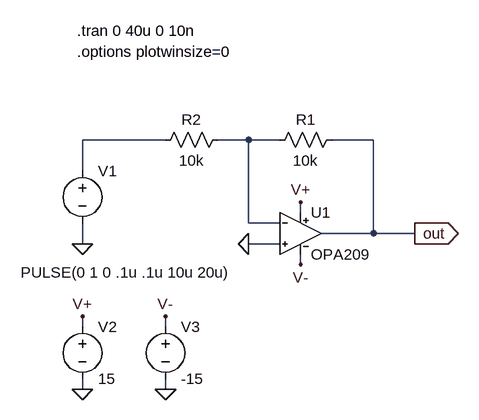
[diagram p0: schematic OPA209_test.asc]
OPA209_test.asc, the LTspice schematic file:
Version 4
SHEET 1 880 680
WIRE 32 48 -96 48
WIRE 160 48 112 48
WIRE 208 48 160 48
WIRE 352 48 288 48
WIRE -96 96 -96 48
WIRE 240 160 240 144
WIRE 160 176 160 48
WIRE 208 176 160 176
WIRE 352 192 352 48
WIRE 352 192 272 192
WIRE 416 192 352 192
WIRE -96 208 -96 176
WIRE 208 208 160 208
WIRE 240 240 240 224
WIRE -96 336 -96 320
WIRE 32 336 32 320
WIRE -96 432 -96 416
WIRE 32 432 32 416
FLAG 240 144 V+
FLAG 240 240 V-
FLAG 160 208 0
FLAG -96 208 0
FLAG 416 192 out
IOPIN 416 192 Out
FLAG 32 432 0
FLAG -96 432 0
FLAG -96 320 V+
FLAG 32 320 V-
SYMBOL res 192 64 R270
WINDOW 0 32 56 VTop 0
WINDOW 3 0 56 VBottom 0
SYMATTR InstName R1
SYMATTR Value 10k
SYMBOL res 16 64 R270
WINDOW 0 32 56 VTop 0
WINDOW 3 0 56 VBottom 0
SYMATTR InstName R2
SYMATTR Value 10k
SYMBOL voltage -96 80 R0
WINDOW 3 -95 172 Left 0
WINDOW 123 0 0 Left 0
WINDOW 39 0 0 Left 0
SYMATTR Value PULSE(0 1 0 .1u .1u 10u 20u)
SYMATTR InstName V1
SYMBOL voltage -96 320 R0
SYMATTR InstName V2
SYMATTR Value 15
SYMBOL voltage 32 320 R0
SYMATTR InstName V3
SYMATTR Value -15
SYMBOL OPA209 240 128 R0
SYMATTR InstName U1
TEXT -104 -120 Left 0 !.tran 0 40u 0 10n
TEXT -104 -88 Left 0 !.options plotwinsize=0

The netlist it stands for:
* OPA209_test.asc
R1 N002 out 10k
R2 N001 N002 10k
V1 N001 0 PULSE(0 1 0 .1u .1u 10u 20u)
V2 V+ 0 15
V3 V- 0 -15
XU1 N002 0 V- V+ out OPA209_0  ; pins In- In+ V- V+ OUT
.tran 0 40u 0 10n
.options plotwinsize=0
.lib opa209.lib
.backanno
.end